# Altium schematic sheet 海关全向控制器主控板电路V2_电源管理.SchDoc
size A4
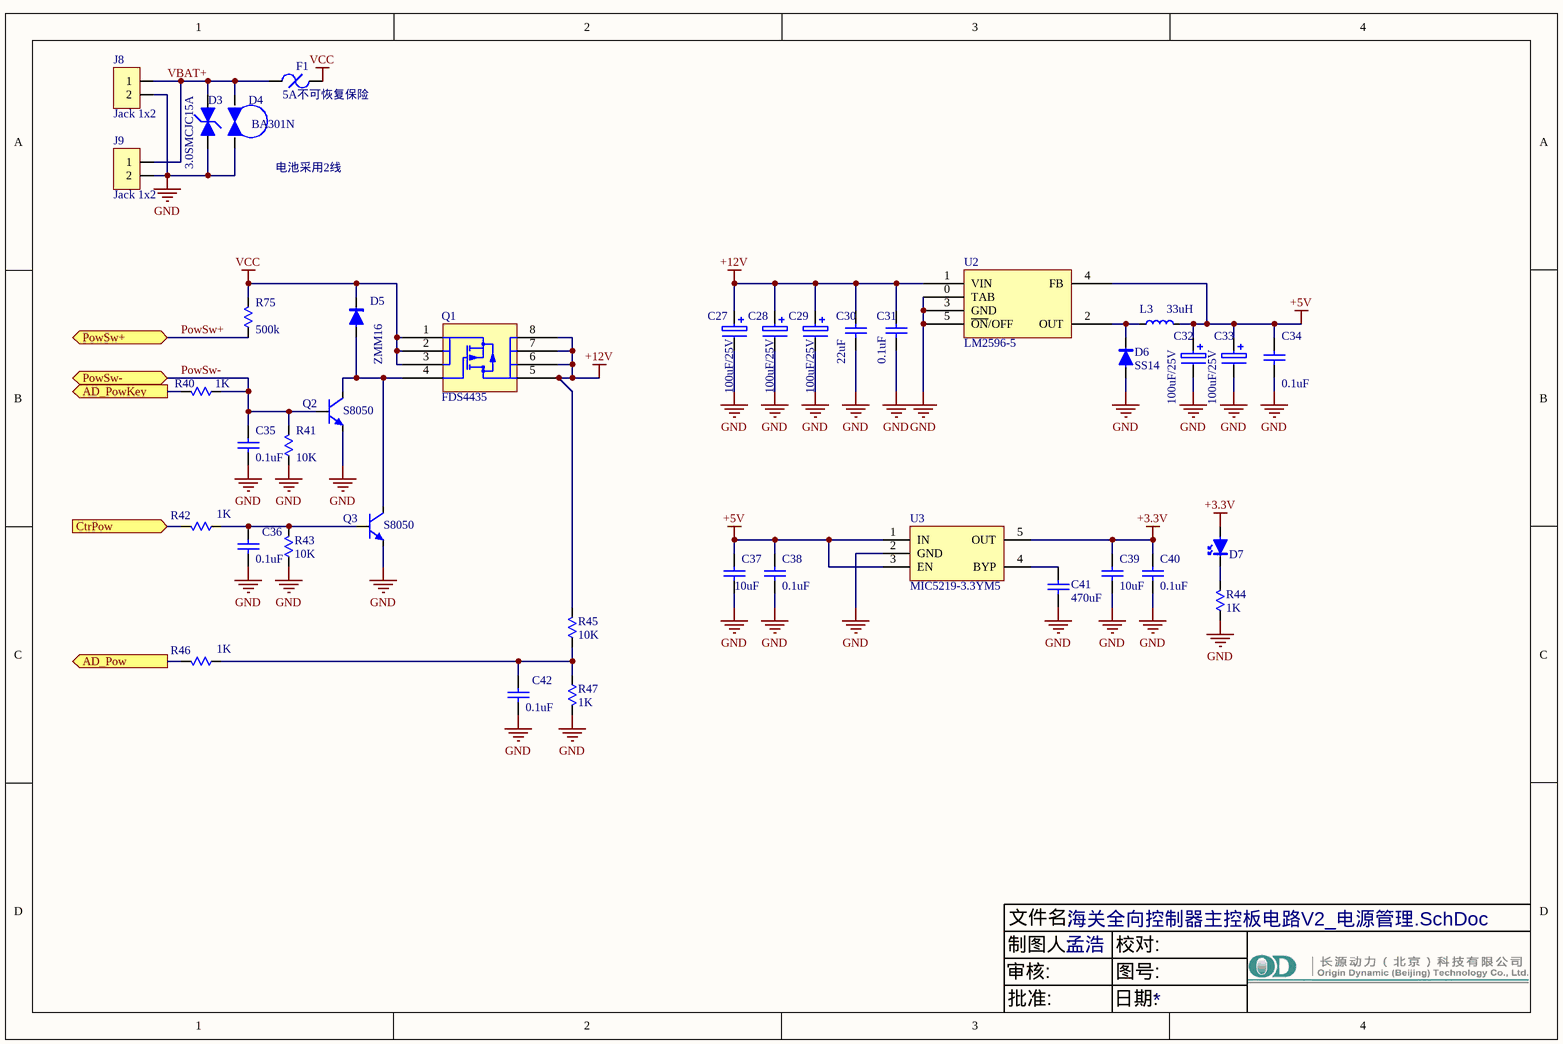
[diagram p0: 海关全向控制器主控板电路V2_电源管理.SchDoc]

## Parts
C27  100uF/25V  [C7343]
C28  100uF/25V  [C7343]
C29  100uF/25V  [C7343]
C30  22uF  [C1206]
C31  0.1uF  [C1206]
C32  100uF/25V  [C7343]
C33  100uF/25V  [C7343]
C34  0.1uF  [C0603]
C35  0.1uF  [C0603]
C36  0.1uF  [C0603]
C37  10uF  [C0603]
C38  0.1uF  [C0603]
C39  10uF  [C0603]
C40  0.1uF  [C0603]
C41  470uF  [C0603]
C42  0.1uF  [C0603]
D3  3.0SMCJC15A  [smc]
D4  BA301N  [BA301N]
D5  ZMM16  [SOD-80-S]
D6  SS14  [SMA]
D7  LED  [LED0603]  (value not drawn)
F1  5A不可恢复保险  [F1218]
J8  Jack 1x2  [ZH-2AWD]
J9  Jack 1x2  [ZH-2AWD]
L3  33uH  [L6.6*7.1mm]
Q1  FDS4435  [SO8]
Q2  S8050  [SOT-23]
Q3  S8050  [SOT-23]
R40  1K  [R0603]
R41  10K  [R0603]
R42  1K  [R0603]
R43  10K  [R0603]
R44  1K  [R0603]
R45  10K  [R0603]
R46  1K  [R0603]
R47  1K  [R0603]
R75  500k  [R0603]
U2  LM2596-5  [TO-263-5]
U3  MIC5219-3.3YM5  [SOT-23-5]

## Ports
AD_Pow (out), AD_PowKey (out), CtrPow (in), PowSw+ (bidir), PowSw- (bidir)

## Nets
+3.3V: C39.1 C40.2 D7.1(A) U3.5(OUT)
+5V: C32.1 C33.1 C34.2 C37.1 C38.2 L3.2 U2.4(FB) U3.1(IN) U3.3(EN)
+12V: C27.1 C28.1 C29.1 C30.1 C31.1 Q1.5 Q1.6 Q1.7 Q1.8 R45.1 U2.1(VIN)
GND: C27.2 C28.2 C29.2 C30.2 C31.2 C32.2 C33.2 C34.1 C35.1 C36.1 C37.2 C38.1 C39.2 C40.1 C41.1 C42.1 D3.2(K) D4.2 D6.1(A) J8.2 J9.2 Q2.2(E) Q3.2(E) R41.2 R43.2 R44.1 R47.1 U2.0(TAB) U2.3(GND) U2.5(~{ON}/OFF) U3.2(GND)
VCC: D5.2(K) F1.2 Q1.1 Q1.2 Q1.3 R75.2
AD_Pow: R46.1 ; port AD_Pow
AD_PowKey: R40.1 ; port AD_PowKey
CtrPow: R42.1 ; port CtrPow
PowSw+: R75.1 ; port PowSw+
PowSw-: C35.2 Q2.1(B) R40.2 R41.1 ; port PowSw-
VBAT+: D3.1(A) D4.1 F1.1 J8.1 J9.1
NetC36_2: C36.2 Q3.1(B) R42.2 R43.1
NetC41_2: C41.2 U3.4(BYP)
NetC42_2: C42.2 R45.2 R46.2 R47.2
NetD5_1: D5.1(A) Q1.4 Q2.3(C) Q3.3(C)
NetD6_2: D6.2(K) L3.1 U2.2(OUT)
NetD7_2: D7.2(K) R44.2

## Notes on the sheet
- 电池采用2线
- 文件名:
- 审核:
- 制图人:
- 孟浩
- 校对:
- 图号:
- 批准:
- 日期:

## Library data of the parts
C27-C29 = Cap Poll
C30 C31 C34-C40 C42 = CAP: Published: 8-Jun-2000; LatestRevisionDate: 17-Jul-2002; LatestRevisionNote: Re-released for DXP Platform.; PackageReference: RAD-0.3; Publisher: Altium Limited
  C30: Value: 22uF
  C31 C34-C36 C38 C40 C42: Value: 0.1uF
  C37 C39: Value: 10uF
C32 C33 = ELECTRO: Electrolytic Capacitor
C41 = Cap Semi
D3 = Diode-TVS
D5 = DIODE-ZENER: Small Signal Zener Diodes
D6 = Diode-Switch: Silicon Epitaxial Planar Diodes
F1 = Fuse2
J8 J9 = Jack 1x2: 插座
L3 = INDUCTOR: Code_IEC: 1005; Published: 8-Jun-2000; LatestRevisionDate: 17-Jul-2002; LatestRevisionNote: Re-released for DXP Platform.; PackageReference: 0402-A; Publisher: Altium Limited; Code_JEITA: 0402
Q2 Q3 = NPN: NPN General Purpose Amplifier; Published: 8-Jun-2000; LatestRevisionDate: 15-Jan-2003; LatestRevisionNote: PCB Footprint 'BCY-W3/D4.7' replaced; DatasheetDocument: 1997; PackageDocument: Sep-1998; PackageReference: TO-92A; Publisher: Altium Limited; Code_JEDEC: TO-92A; ComponentLink1Description: Manufacturer Link; ComponentLink1URL: http://www.fairchildsemi.com/; ComponentLink2Description: Datasheet; ComponentLink2URL: http://www.fairchildsemi.com/ds/2N%2F2N3904.pdf
R40-R47 R75 = Res: Resistor; Published: 8-Jun-2000; LatestRevisionDate: 04-Mar-2005; LatestRevisionNote: PCB Footprint replaced.; PackageReference: J1-0603; Publisher: Altium Limited
  R41 R43 R45: Value: 10K
  R42 R44 R46 R47: Value: 1K
  R75: Value: 500k
U2 = LM25x6-5: LM2596-5;LM2576-5
U3 = MIC5205